# Altium schematic sheet USB-IRIS-W1_TOP_01.SchDoc: PCB-USB-NORA-W1
size A3; Date: 09/17/2021; CompanyName: U-Blox; DrawnBy: ASOH/HEKF; Engineer: ASOH/HEKF; Organization: U-Blox; Address1: Östra Varvsgatan 4; Address2: SE-211 75 Malmo; DocumentNumber: 1; SheetNumber: 1; SheetTotal: 4; SheetSize: B; SheetTitle: TopSheet
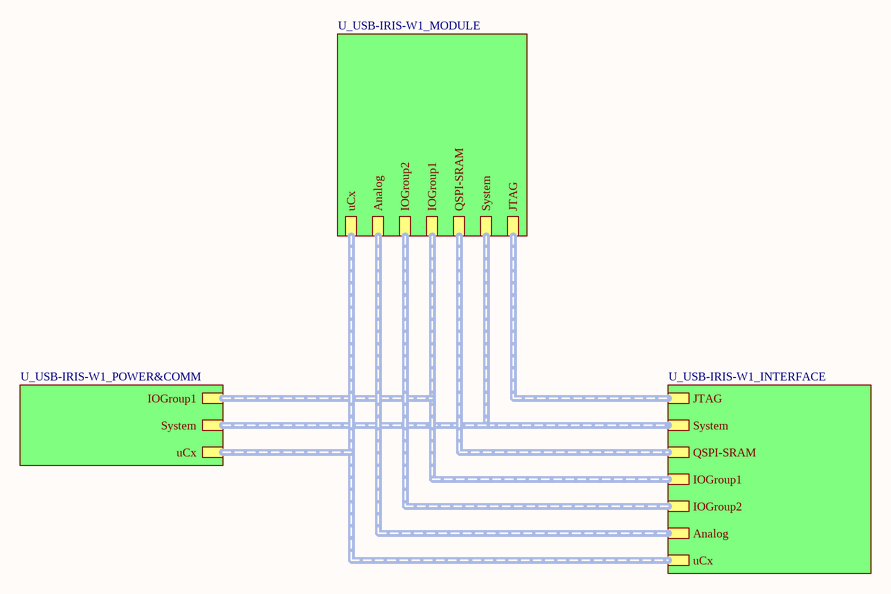
[diagram p0: USB-IRIS-W1_TOP_01.SchDoc]

## Sub-sheets
U_USB-IRIS-W1_INTERFACE = USB-IRIS-W1_INTERFACE.SchDoc: JTAG (harness JTAG), QSPI-SRAM (harness QSPI-SRAM), IOGroup2 (harness IOGroup2), Analog (harness Analog), uCx (harness uCx), IOGroup1 (harness IOGroup1), System (harness System)
U_USB-IRIS-W1_MODULE = USB-IRIS-W1_MODULE.SchDoc: JTAG (harness JTAG), QSPI-SRAM (harness QSPI-SRAM), IOGroup2 (harness IOGroup2), Analog (harness Analog), uCx (harness uCx), IOGroup1 (harness IOGroup1), System (harness System)
U_USB-IRIS-W1_POWER&COMM = USB-IRIS-W1_POWER&COMM.SchDoc: uCx (harness uCx), System (harness System), IOGroup1 (harness IOGroup1)

## Buses and harness runs
harness sheet U_USB-IRIS-W1_INTERFACE/Analog = sheet U_USB-IRIS-W1_MODULE/Analog
harness sheet U_USB-IRIS-W1_INTERFACE/IOGroup1 = sheet U_USB-IRIS-W1_MODULE/IOGroup1 = sheet U_USB-IRIS-W1_POWER&COMM/IOGroup1
harness sheet U_USB-IRIS-W1_INTERFACE/IOGroup2 = sheet U_USB-IRIS-W1_MODULE/IOGroup2
harness sheet U_USB-IRIS-W1_INTERFACE/JTAG = sheet U_USB-IRIS-W1_MODULE/JTAG
harness sheet U_USB-IRIS-W1_INTERFACE/QSPI-SRAM = sheet U_USB-IRIS-W1_MODULE/QSPI-SRAM
harness sheet U_USB-IRIS-W1_INTERFACE/System = sheet U_USB-IRIS-W1_MODULE/System = sheet U_USB-IRIS-W1_POWER&COMM/System
harness sheet U_USB-IRIS-W1_INTERFACE/uCx = sheet U_USB-IRIS-W1_MODULE/uCx = sheet U_USB-IRIS-W1_POWER&COMM/uCx

## Notes on the sheet
- Rev.
- Description
- Schematic/Assembly Revision
- Date
- By
- Prepared By
- Revision:
- CONFIDENTIAL
- Page:
- Size:
- A3